# Altium project ife18_TS_BMS_Master_STM32.PrjPcb
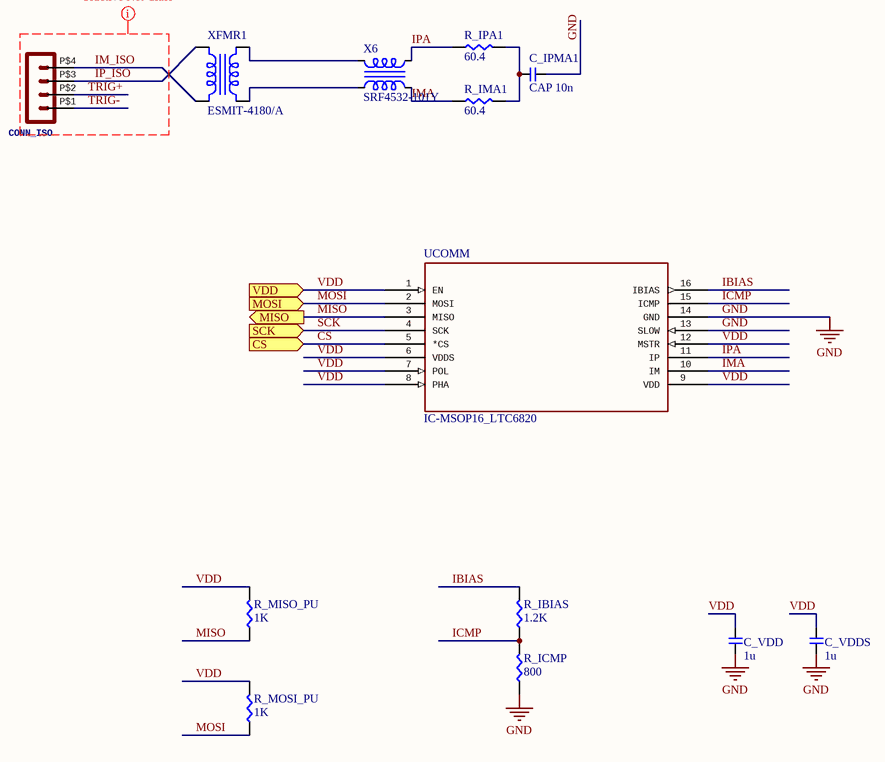
[diagram p0: Comms.SchDoc]
2 sheets, 30 parts. Net scope: flat (ports and power ports of the same name join across sheets).
Board file: ife18_TS_BMS_Master_STM32.PcbDoc
Sheets:
  Comms.SchDoc
  Precharge.SchDoc

## Sheet Comms.SchDoc
size A

### Parts
(Parts that share a designator on the sheet are numbered #1, #2 ... from top to bottom, then left to right.)
C_IPMA1  CAP 10n  [CAP-0603]
C_VDD#1  1u  [CAP-0603]
C_VDDS  1u  [CAP-0603]
CONN_ISO  Molex - Micro-Fit 3.0 Series connector,  3.00mm (0.118") pitch header, 4 positions.  [43650-0424]  (value not drawn)
R_IBIAS  1.2K  [RES-0603]
R_ICMP  800  [RES-0603]
R_IMA1  60.4  [RES-0603]
R_IPA1  60.4  [RES-0603]
R_MISO_PU  1K  [RES-0603]
R_MOSI_PU  1K  [RES-0603]
UCOMM  IC-MSOP16_LTC6820  [MSOP16]
X6  SRF4532-101Y  [SRF4532]
XFMR1  ESMIT-4180/A  [ISOXFMR_ESMIT4180]

### Ports
CS (in), MISO (out), MOSI (in), SCK (in), VDD (in)

### Nets
GND: C_IPMA1.1 C_VDD#1.1 C_VDDS.1 R_ICMP.1 UCOMM.13(SLOW) UCOMM.14(GND)
CS: UCOMM.5(*CS) ; port CS
IBIAS: R_IBIAS.2 UCOMM.16(IBIAS)
ICMP: R_IBIAS.1 R_ICMP.2 UCOMM.15(ICMP)
IM_ISO: CONN_ISO.P$4 XFMR1.1
IMA: R_IMA1.2 UCOMM.10(IM) X6.1
IP_ISO: CONN_ISO.P$3 XFMR1.2
IPA: R_IPA1.2 UCOMM.11(IP) X6.4
MISO: R_MISO_PU.1 UCOMM.3(MISO) ; port MISO
MOSI: R_MOSI_PU.1 UCOMM.2(MOSI) ; port MOSI
SCK: UCOMM.4(SCK) ; port SCK
TRIG+: CONN_ISO.P$2
TRIG-: CONN_ISO.P$1
VDD: C_VDD#1.2 C_VDDS.2 R_MISO_PU.2 R_MOSI_PU.2 UCOMM.1(EN) UCOMM.6(VDDS) UCOMM.7(POL) UCOMM.8(PHA) UCOMM.9(VDD) UCOMM.12(MSTR) ; port VDD
NetC_IPMA1_2: C_IPMA1.2 R_IMA1.1 R_IPA1.1
NetX6_2: X6.2 XFMR1.4
NetX6_3: X6.3 XFMR1.3

### Layout directives
net class Tractive: IM_ISO, IP_ISO, TRIG+, TRIG-

### Library data of the parts
C_IPMA1 C_VDD#1 C_VDDS = CAP-0603
CONN_ISO = POS4_MF43650-0424: GateName_1: G$1; SymbolName_1: HEADER_POS4; DeviceSetName: HEADER_POS4_?; DeviceName: 43650-0424; LibraryName: MOLEX Micro-Fit; Package: 43650-0424
R_IBIAS R_ICMP R_IMA1 R_IPA1 R_MISO_PU R_MOSI_PU = RES-0603
X6 = CMC_SRF4532
XFMR1 = ISOXFMR_ESMIT4180

## Sheet Precharge.SchDoc: Precharge
size 241 x 127 mm; Date: 1/4/2019 10:42:01 PM; SheetNumber: 1; GateName_1: G$1; SymbolName_1: LETTER_L; LibraryName: frames; DeviceSetName: LETTER_L; GateName_2: G$2; SymbolName_2: DOCFIELD
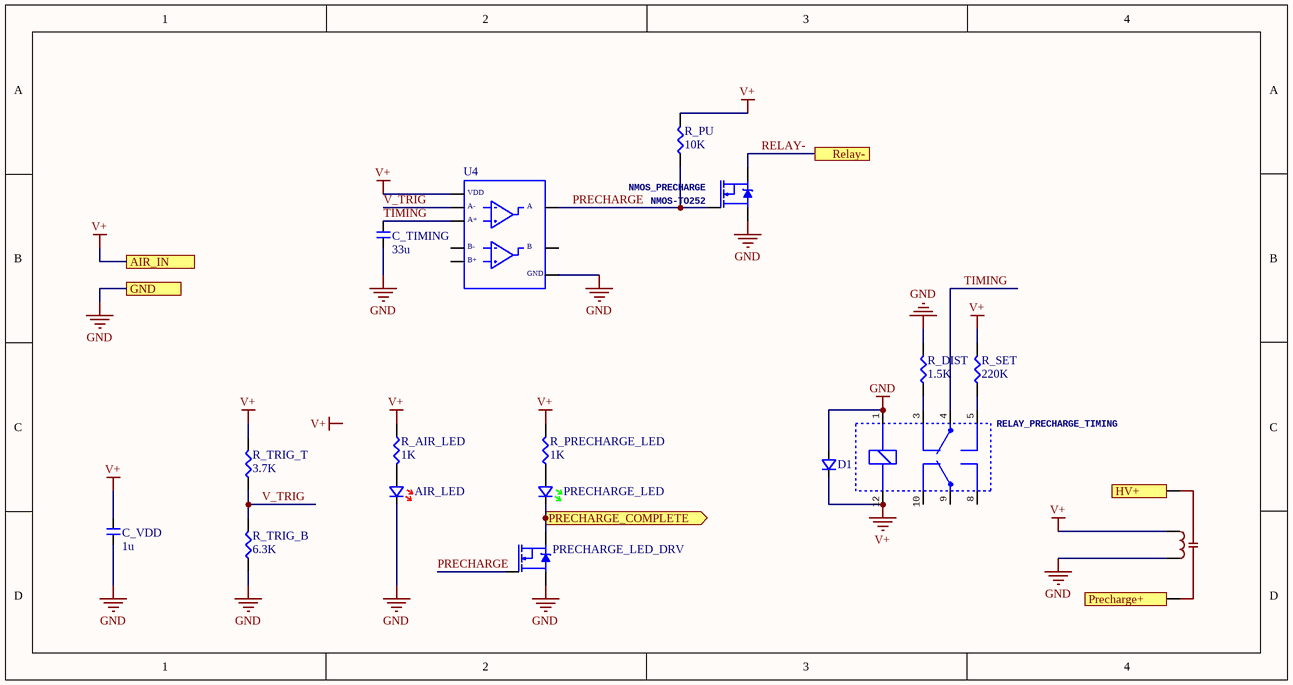
[diagram p1: Precharge.SchDoc]

### Parts
(Parts that share a designator on the sheet are numbered #1, #2 ... from top to bottom, then left to right.)
AIR_LED  (no value)  [LEDRED-0603]
C_TIMING  33u  [CAP-0603]
C_VDD#2  1u  [CAP-0603]
D1  (no value)  [DO41-10]
NMOS_PRECHARGE  NMOS-TO252  [TO252]
PRECHARGE_LED  (no value)  [LEDGREEN-0603]
PRECHARGE_LED_DRV  (no value)  [SOT23]
R_AIR_LED  1K  [RES-0603]
R_DIST  1.5K  [RES-0603]
R_PRECHARGE_LED  1K  [RES-0603]
R_PU  10K  [RES-0603]
R_SET  220K  [RES-0603]
R_TRIG_B  6.3K  [RES-0603]
R_TRIG_T  3.7K  [RES-0603]
RELAY_PRECHARGE  COTO9104  [9104-SIP4]  (value not drawn)
RELAY_PRECHARGE_TIMING  (no value)  [RELAY-DPDT_EC2]
U4  (no value)  [SOIC8]

### Ports
AIR_IN, GND, HV+, Precharge+, PRECHARGE_COMPLETE (out), Relay-

### Nets
GND: AIR_LED.K C_TIMING.1 C_VDD#2.1 D1.A NMOS_PRECHARGE.2(S) PRECHARGE_LED_DRV.2(S) R_DIST.2 R_TRIG_B.1 RELAY_PRECHARGE.5 RELAY_PRECHARGE_TIMING.1 U4.4 ; port GND
V+: C_VDD#2.2 D1.K R_AIR_LED.1 R_PRECHARGE_LED.2 R_PU.2 R_SET.2 R_TRIG_T.2 RELAY_PRECHARGE.3 RELAY_PRECHARGE_TIMING.12 U4.8 ; port AIR_IN
PRECHARGE: NMOS_PRECHARGE.1(G) PRECHARGE_LED_DRV.1(G) R_PU.1 U4.1
RELAY-: NMOS_PRECHARGE.3(D) ; port Relay-
TIMING: C_TIMING.2 RELAY_PRECHARGE_TIMING.4 U4.3
V_TRIG: R_TRIG_B.2 R_TRIG_T.1 U4.2
NetAIR_LED_A: AIR_LED.A R_AIR_LED.2
NetPRECHARGE_LED_A: PRECHARGE_LED.A R_PRECHARGE_LED.1
NetPRECHARGE_LED_K: PRECHARGE_LED.K PRECHARGE_LED_DRV.3(D) ; port PRECHARGE_COMPLETE
NetR_DIST_1: R_DIST.1 RELAY_PRECHARGE_TIMING.3
NetR_SET_1: R_SET.1 RELAY_PRECHARGE_TIMING.5
NetRELAY_PRECHARGE_1: RELAY_PRECHARGE.1 ; port HV+
NetRELAY_PRECHARGE_7: RELAY_PRECHARGE.7 ; port Precharge+

Not connected (* = marked no-connect by the designer): RELAY_PRECHARGE_TIMING 8 9 10; U4 5 6 7

### Notes on the sheet
- Labels drawn without touching a wire or pin: V+
- Title
- Size:
- Date:
- A
- Number:
- Time:
- Revision:
- Sheet
- of
- File:
- (in symbol IC-SOIC8_LM393) VDD; A-; A; A+; B-; B; B+; GND

### Library data of the parts
AIR_LED = LEDRED-0603
C_TIMING C_VDD#2 = CAP-0603
D1 = DIODE-DO41-10
NMOS_PRECHARGE = NMOS-TO252: GateName_1: G$1; SymbolName_1: LABELED-PMOS; DeviceSetName: DMP10H400SK3-13; LibraryName: IFE_Transistors; Package: TO252
PRECHARGE_LED = LEDGREEN-0603
PRECHARGE_LED_DRV = NMOS-SOT23
R_AIR_LED R_DIST R_PRECHARGE_LED R_PU R_SET R_TRIG_B R_TRIG_T = RES-0603
RELAY_PRECHARGE = COTO9104: GateName_1: G$1; SymbolName_1: SPST_REED; LibraryName: Discharge_Components_Altium_Export; DeviceSetName: COTO9104; Package: 9104-SIP4
RELAY_PRECHARGE_TIMING = RELAY_EC2: GateName_1: G$1; SymbolName_1: MONOSTABLERELAY; DeviceSetName: EC2; LibraryName: KEMET; Package: DPDT_2.54
U4 = IC-SOIC8_LM393

## Nets that join several sheets
GND: Comms (6 pins), Precharge (11 pins)